# Altium project MCU_board.PrjPcb
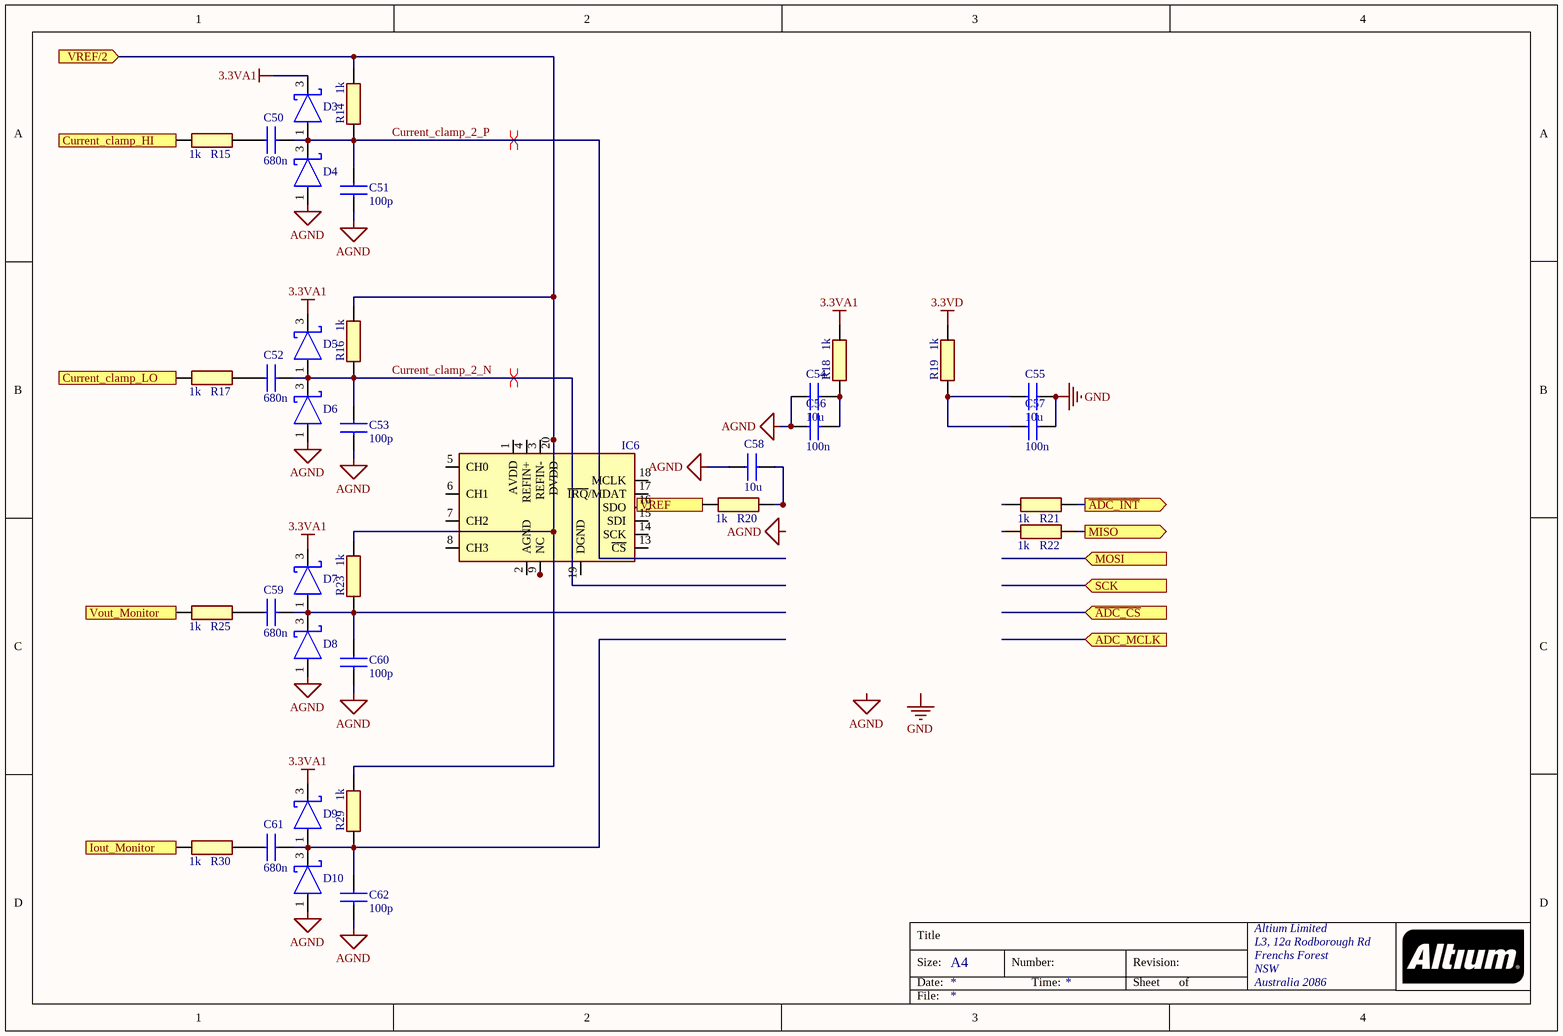
[diagram p0: ADC.SchDoc]
2 sheets, 148 parts. Net scope: flat (ports and power ports of the same name join across sheets).
Board file: analog_and_digital_gnd.PcbDoc
Sheets:
  ADC.SchDoc
  Main.SchDoc

## Sheet ADC.SchDoc
size A4; Organization: Altium Limited; Address1: L3, 12a Rodborough Rd; Address2: Frenchs Forest; Address3: NSW; Address4: Australia 2086

### Parts
C50  value 680n  [R82DC3680AA60J]  (hidden comment: R82DC3680AA60J)
C51  value 100p  [CAPC2012X140N]  (hidden comment: Capacitor_SMD)
C52  value 680n  [R82DC3680AA60J]  (hidden comment: R82DC3680AA60J)
C53  value 100p  [CAPC2012X140N]  (hidden comment: Capacitor_SMD)
C54  value 10u  [CAPC2012X140N]  (hidden comment: Capacitor_SMD)
C55  value 10u  [CAPC2012X140N]  (hidden comment: Capacitor_SMD)
C56  value 100n  [CAPC2012X140N]  (hidden comment: Capacitor_SMD)
C57  value 100n  [CAPC2012X140N]  (hidden comment: Capacitor_SMD)
C58  value 10u  [CAPC2012X140N]  (hidden comment: Capacitor_SMD)
C59  value 680n  [R82DC3680AA60J]  (hidden comment: R82DC3680AA60J)
C60  value 100p  [CAPC2012X140N]  (hidden comment: Capacitor_SMD)
C61  value 680n  [R82DC3680AA60J]  (hidden comment: R82DC3680AA60J)
C62  value 100p  [CAPC2012X140N]  (hidden comment: Capacitor_SMD)
D3  BAS40  [SOT65P210X110-3N]  (value not drawn)
D4  BAS40  [SOT65P210X110-3N]  (value not drawn)
D5  BAS40  [SOT65P210X110-3N]  (value not drawn)
D6  BAS40  [SOT65P210X110-3N]  (value not drawn)
D7  BAS40  [SOT65P210X110-3N]  (value not drawn)
D8  BAS40  [SOT65P210X110-3N]  (value not drawn)
D9  BAS40  [SOT65P210X110-3N]  (value not drawn)
D10  BAS40  [SOT65P210X110-3N]  (value not drawn)
IC6  MCP3462T-E_NC  [SOP65P640X120-20N]  (value not drawn)
R14  value 1k  [RESC2012X60N]  (hidden comment: Res_SMD)
R15  value 1k  [RESC2012X60N]  (hidden comment: Res_SMD)
R16  value 1k  [RESC2012X60N]  (hidden comment: Res_SMD)
R17  value 1k  [RESC2012X60N]  (hidden comment: Res_SMD)
R18  value 1k  [RESC2012X60N]  (hidden comment: Res_SMD)
R19  value 1k  [RESC2012X60N]  (hidden comment: Res_SMD)
R20  value 1k  [RESC2012X60N]  (hidden comment: Res_SMD)
R21  value 1k  [RESC2012X60N]  (hidden comment: Res_SMD)
R22  value 1k  [RESC2012X60N]  (hidden comment: Res_SMD)
R23  value 1k  [RESC2012X60N]  (hidden comment: Res_SMD)
R25  value 1k  [RESC2012X60N]  (hidden comment: Res_SMD)
R29  value 1k  [RESC2012X60N]  (hidden comment: Res_SMD)
R30  value 1k  [RESC2012X60N]  (hidden comment: Res_SMD)

### Ports
ADC_MCLK (in), Current_clamp_HI (in), Current_clamp_LO (in), Iout_Monitor (in), MISO (out), MOSI (in), SCK (in), Vout_Monitor (in), VREF (in), VREF/2 (in), ~{ADC_CS} (in), ~{ADC_INT} (out)

### Nets
3.3VA1: D3.3(K) D5.3(K) D7.3(K) D9.3(K) R18.2
3.3VD: R19.2
AGND: C51.2 C53.2 C54.2 C56.2 C58.2 C60.2 C62.2 D4.1(A) D6.1(A) D8.1(A) D10.1(A)
GND: C55.1 C57.1
~{ADC_INT}: R21.1 ; port ~{ADC_INT}
Current_clamp_2_N: C52.2 C53.1 D5.1(A) D6.3(K) R16.1
Current_clamp_2_P: C50.2 C51.1 D3.1(A) D4.3(K) R14.1
Current_clamp_HI: R15.2 ; port Current_clamp_HI
Current_clamp_LO: R17.2 ; port Current_clamp_LO
Iout_Monitor: R30.2 ; port Iout_Monitor
MISO: R22.1 ; port MISO
Vout_Monitor: R25.2 ; port Vout_Monitor
VREF: R20.2 ; port VREF
VREF/2: IC6.20(DVDD) R14.2 R16.2 R23.2 R29.2 ; port VREF/2
NetC50_1: C50.1 R15.1
NetC52_1: C52.1 R17.1
NetC54_1: C54.1 C56.1 R18.1
NetC55_2: C55.2 C57.2 R19.1
NetC58_1: C58.1 R20.1
NetC59_1: C59.1 R25.1
NetC59_2: C59.2 C60.1 D7.1(A) D8.3(K) R23.1
NetC61_1: C61.1 R30.1
NetC61_2: C61.2 C62.1 D9.1(A) D10.3(K) R29.1
NetIC6_9: IC6.9(NC) IC6.10(NC) IC6.11(NC) IC6.12(NC)

Not connected (* = marked no-connect by the designer): IC6 1(AVDD) 2(AGND) 3(REFIN-) 4(REFIN+) 5(CH0) 6(CH1) 7(CH2) 8(CH3) 13(~{CS}) 14(SCK) 15(SDI) 16(SDO) 17(~{IRQ}/MDAT) 18(MCLK) 19(DGND); R21 2; R22 2

### Layout directives
differential pair: Current_clamp_2_N, Current_clamp_2_P

### Notes on the sheet
- Labels drawn without touching a wire or pin: AGND, GND
- Title
- Size:
- Date:
- A4
- Number:
- Time:
- Revision:
- Sheet
- of
- File:

### Library data of the parts
C50 C52 C59 C61 = R82DC3680AA60J: Capacitor; Manufacturer_Name: Kemet; Datasheet Link: https://www.kemet.com/specsheet/R82DC3680AA60J; Height: 9.6mm; Manufacturer_Part_Number: R82DC3680AA60J; Mouser Part Number: 80-R82DC3680AA60J; Mouser Price/Stock: https://www.mouser.com/Search/Refine.aspx?Keyword=80-R82DC3680AA60J; Arrow Part Number: R82DC3680AA60J; Arrow Price/Stock: https://www.arrow.com/en/products/r82dc3680aa60j/kemet-corporation
C51 C53-C58 C60 C62 = Capacitor_SMD: Capacitor smd ceramic; Manufacturer_Name: TDK; Manufacturer_Part_Number: C3216C0G1H562J060AA; Datasheet Link: https://product.tdk.com/info/en/catalog/datasheets/mlcc_commercial_midvoltage_en.pdf; Height: 0.75mm
D3-D10 = BAS40: Diode; Manufacturer_Name: Nexperia; Manufacturer_Part_Number: BAS40-04W,115; Datasheet Link: https://assets.nexperia.com/documents/data-sheet/BAS40_1PSXXSB4X_SER.pdf; Height: 1.1mm; Mouser Part Number: 771-BAS40-04W-T/R; Mouser Price/Stock: https://www.mouser.co.uk/ProductDetail/Nexperia/BAS40-04W115?qs=me8TqzrmIYWDwJcnI64JHw%3D%3D; Arrow Part Number: BAS40-04W,115; Arrow Price/Stock: https://www.arrow.com/en/products/bas40-04w115/nexperia?region=nac
IC6 = MCP3462T-E_NC: Integrated Circuit; Manufacturer_Name: Microchip; Manufacturer_Part_Number: MCP3462T-E/NC; Datasheet Link: http://ww1.microchip.com/downloads/en/DeviceDoc/MCP3461-2-4_Data-Sheet-20006180A.pdf; Height: 0.6mm; Mouser Part Number: 579-MCP3462T-E/NC; Mouser Price/Stock: https://www.mouser.co.uk/ProductDetail/Microchip-Technology/MCP3462T-E-NC?qs=byeeYqUIh0NcNWUdwm8hpg%3D%3D
R14-R23 R25 R29 R30 = Res_SMD: Resistor SMD; Manufacturer_Name: Bourns; Manufacturer_Part_Number: CR1206-FW-1504ELF; Datasheet Link: http://componentsearchengine.com/Datasheets/1/CR1206-FW-1504ELF.pdf; Height: 0.75mm; Mouser Part Number: 652-CR1206FW1504ELF; Mouser Price/Stock: https://www.mouser.co.uk/ProductDetail/Bourns/CR1206-FW-1504ELF/?qs=6oMev5NRZMFfvXkOpYL2%252BA%3D%3D; Arrow Part Number: CR1206-FW-1504ELF; Arrow Price/Stock: https://www.arrow.com/en/products/cr1206-fw-1504elf/bourns

## Sheet Main.SchDoc
size A3; Organization: Altium Limited; Address1: L3, 12a Rodborough Rd; Address2: Frenchs Forest; Address3: NSW; Address4: Australia 2086
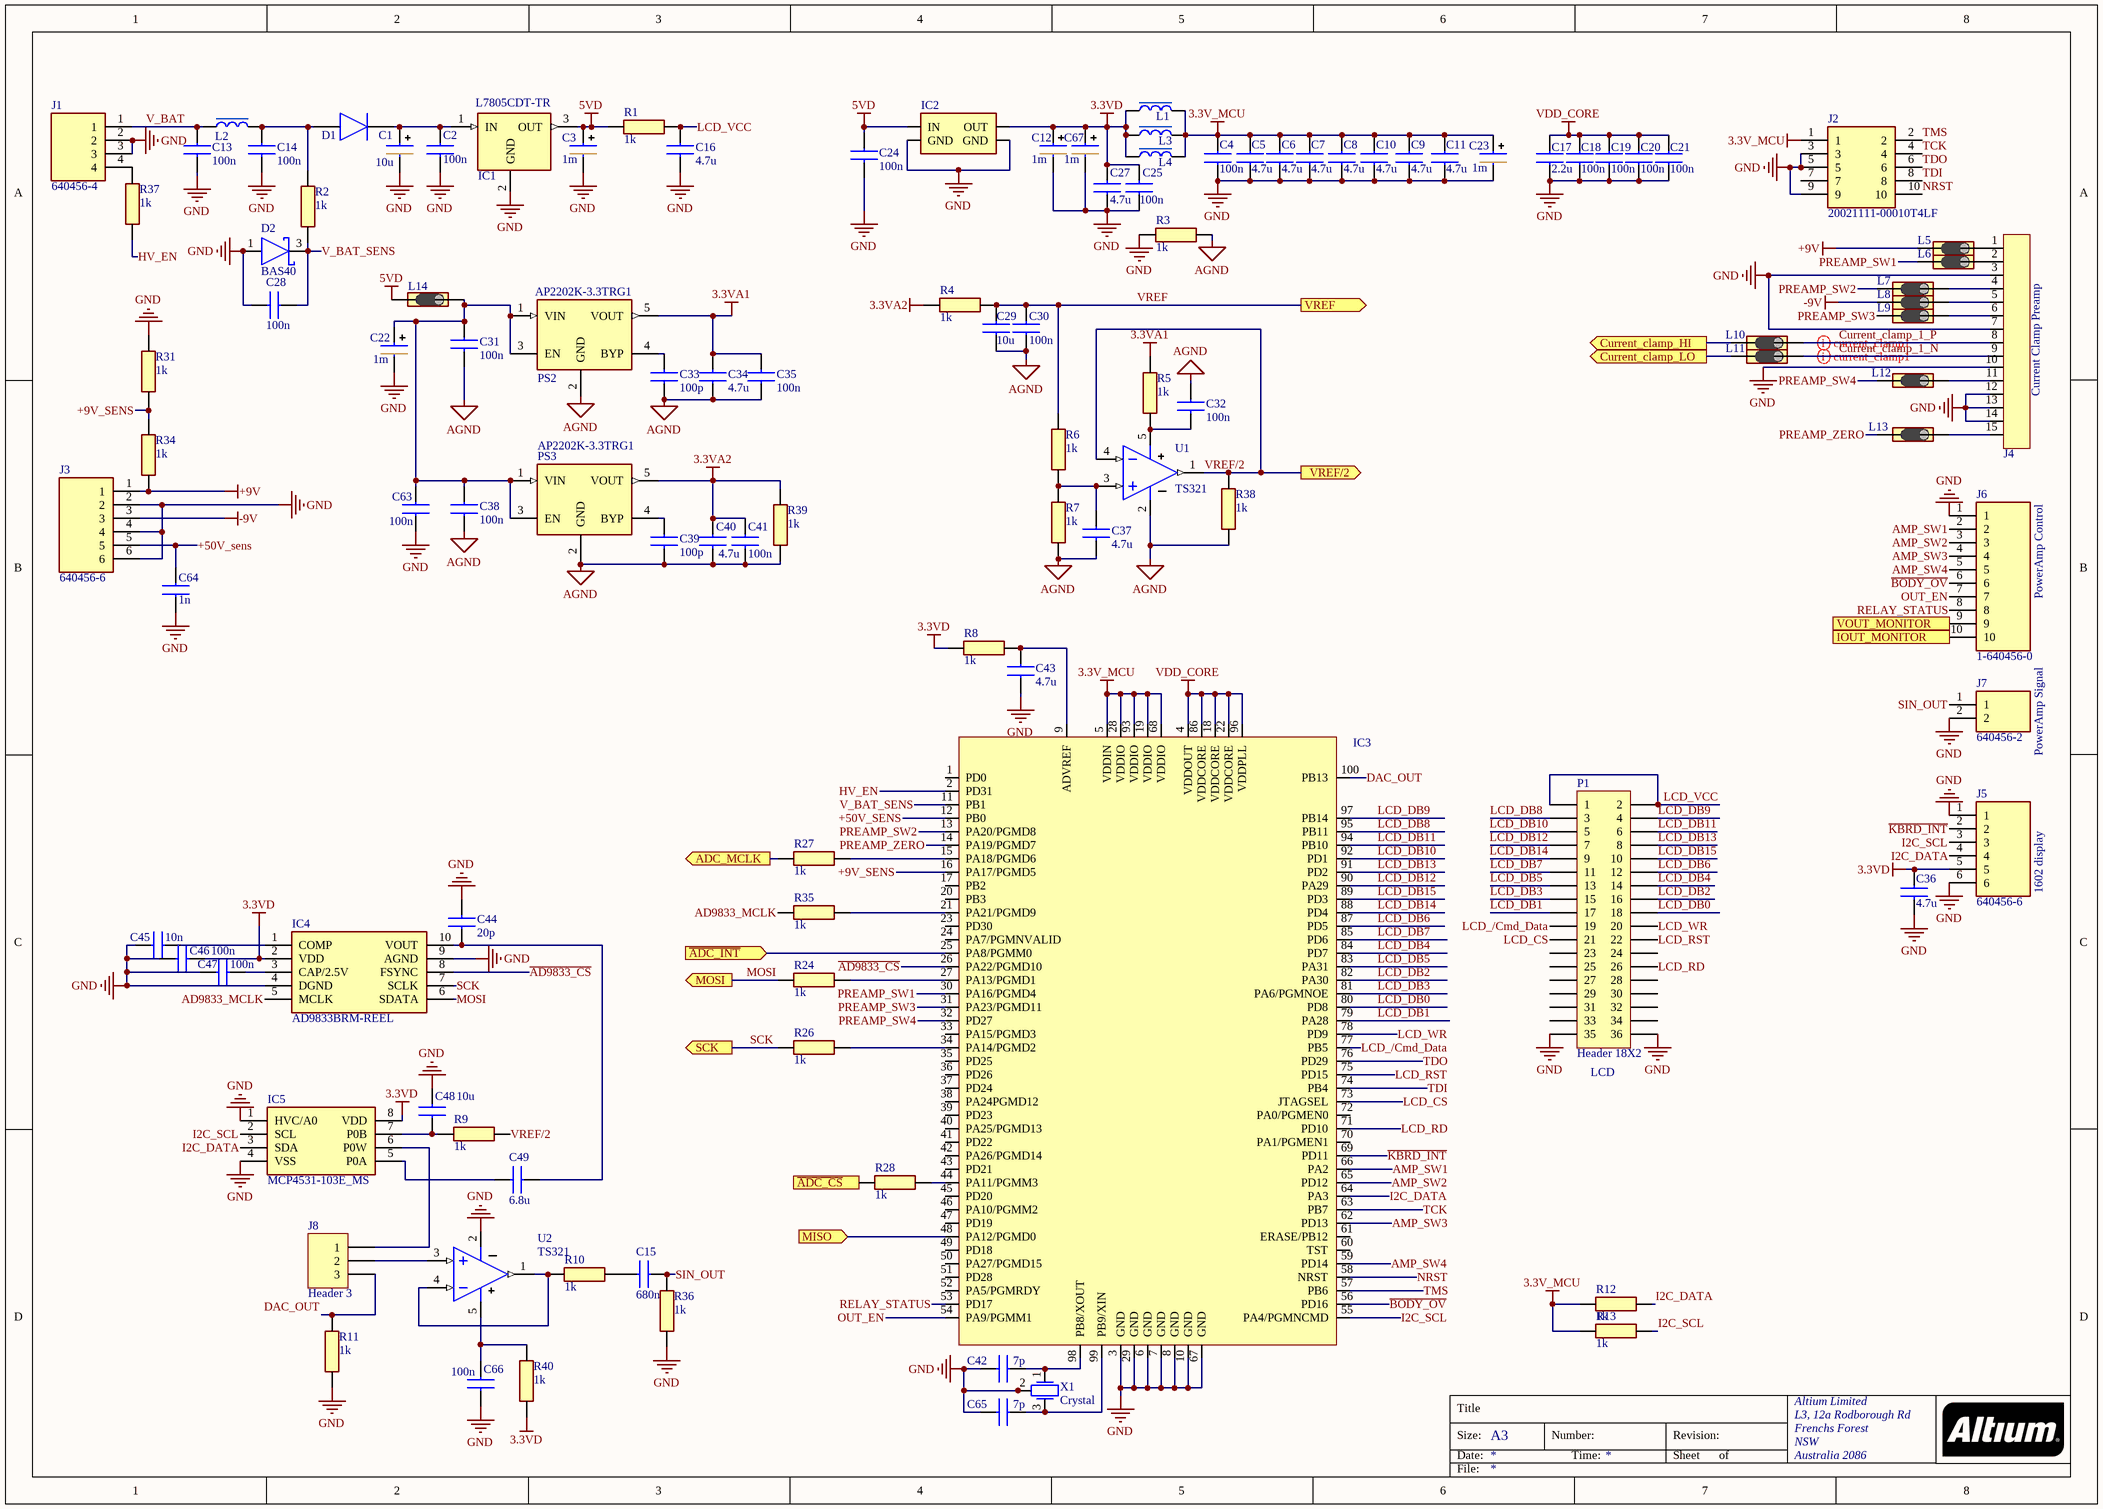
[diagram p1: Main.SchDoc]

### Parts
C1  value 10u  [CAP_EL_8X12R3_5]  (hidden comment: Capacitor Electrolytic)
C2  value 100n  [CAPC2012X140N]  (hidden comment: Capacitor_SMD)
C3  value 1m  [CAP_EL_8X12R3_5]  (hidden comment: Capacitor Electrolytic)
C4  value 100n  [CAPC2012X140N]  (hidden comment: Capacitor_SMD)
C5  value 4.7u  [CAPC2012X140N]  (hidden comment: Capacitor_SMD)
C6  value 4.7u  [CAPC2012X140N]  (hidden comment: Capacitor_SMD)
C7  value 4.7u  [CAPC2012X140N]  (hidden comment: Capacitor_SMD)
C8  value 4.7u  [CAPC2012X140N]  (hidden comment: Capacitor_SMD)
C9  value 4.7u  [CAPC2012X140N]  (hidden comment: Capacitor_SMD)
C10  value 4.7u  [CAPC2012X140N]  (hidden comment: Capacitor_SMD)
C11  value 4.7u  [CAPC2012X140N]  (hidden comment: Capacitor_SMD)
C12  value 1m  [CAP_EL_8X12R3_5]  (hidden comment: Capacitor Electrolytic)
C13  value 100n  [CAPC2012X140N]  (hidden comment: Capacitor_SMD)
C14  value 100n  [CAPC2012X140N]  (hidden comment: Capacitor_SMD)
C15  value 680n  [R82DC3680AA60J]  (hidden comment: R82DC3680AA60J)
C16  value 4.7u  [CAPC2012X140N]  (hidden comment: Capacitor_SMD)
C17  value 2.2u  [CAPC2012X140N]  (hidden comment: Capacitor_SMD)
C18  value 100n  [CAPC2012X140N]  (hidden comment: Capacitor_SMD)
C19  value 100n  [CAPC2012X140N]  (hidden comment: Capacitor_SMD)
C20  value 100n  [CAPC2012X140N]  (hidden comment: Capacitor_SMD)
C21  value 100n  [CAPC2012X140N]  (hidden comment: Capacitor_SMD)
C22  value 1m  [CAP_EL_8X12R3_5]  (hidden comment: Capacitor Electrolytic)
C23  value 1m  [CAP_EL_8X12R3_5]  (hidden comment: Capacitor Electrolytic)
C24  value 100n  [CAPC2012X140N]  (hidden comment: Capacitor_SMD)
C25  value 100n  [CAPC2012X140N]  (hidden comment: Capacitor_SMD)
C27  value 4.7u  [CAPC2012X140N]  (hidden comment: Capacitor_SMD)
C28  value 100n  [CAPC2012X140N]  (hidden comment: Capacitor_SMD)
C29  value 10u  [CAPC2012X140N]  (hidden comment: Capacitor_SMD)
C30  value 100n  [CAPC2012X140N]  (hidden comment: Capacitor_SMD)
C31  value 100n  [CAPC2012X140N]  (hidden comment: Capacitor_SMD)
C32  value 100n  [CAPC2012X140N]  (hidden comment: Capacitor_SMD)
C33  value 100p  [CAPC2012X140N]  (hidden comment: Capacitor_SMD)
C34  value 4.7u  [CAPC2012X140N]  (hidden comment: Capacitor_SMD)
C35  value 100n  [CAPC2012X140N]  (hidden comment: Capacitor_SMD)
C36  value 4.7u  [CAPC2012X140N]  (hidden comment: Capacitor_SMD)
C37  value 4.7u  [CAPC2012X140N]  (hidden comment: Capacitor_SMD)
C38  value 100n  [CAPC2012X140N]  (hidden comment: Capacitor_SMD)
C39  value 100p  [CAPC2012X140N]  (hidden comment: Capacitor_SMD)
C40  value 4.7u  [CAPC2012X140N]  (hidden comment: Capacitor_SMD)
C41  value 100n  [CAPC2012X140N]  (hidden comment: Capacitor_SMD)
C42  value 7p  [CAPC2012X140N]  (hidden comment: Capacitor_SMD)
C43  value 4.7u  [CAPC2012X140N]  (hidden comment: Capacitor_SMD)
C44  value 20p  [CAPC2012X140N]  (hidden comment: Capacitor_SMD)
C45  value 10n  [CAPC2012X140N]  (hidden comment: Capacitor_SMD)
C46  value 100n  [CAPC2012X140N]  (hidden comment: Capacitor_SMD)
C47  value 100n  [CAPC2012X140N]  (hidden comment: Capacitor_SMD)
C48  value 10u  [CAPC2012X140N]  (hidden comment: Capacitor_SMD)
C49  value 6.8u  [CAPC2012X140N]  (hidden comment: Capacitor_SMD)
C63  value 100n  [CAPC2012X140N]  (hidden comment: Capacitor_SMD)
C64  value 1n  [CAPC2012X140N]  (hidden comment: Capacitor_SMD)
C65  value 7p  [CAPC2012X140N]  (hidden comment: Capacitor_SMD)
C66  value 100n  [CAPC2012X140N]  (hidden comment: Capacitor_SMD)
C67  value 1m  [CAP_EL_8X12R3_5]  (hidden comment: Capacitor Electrolytic)
D1  S2B-13-F  [DIOM5336X250N]  (value not drawn)
D2  BAS40  [SOT65P210X110-3N]
IC1  L7805CDT-TR  [L7805CDTTR]
IC2  AP130-33YG-13  [SOT89-3L]  (value not drawn)
IC3  ATSAM4E8CB  [QFP50P1600X1600X160-100N]  (value not drawn)
IC4  AD9833BRM-REEL  [SOP50P490X110-10N]
IC5  MCP4531-103E_MS  [SOP65P490X110-8N]
J1  640456-4  [SHDR4W66P0X254_1X4_1016X572X1041P]
J2  20021111-00010T4LF  [HDRV10W41P127_2X5_635X343X575P]
J3  640456-6  [SHDR6W66P0X254_1X6_1524X572X1003P]
J4  D-Sub 15 pin  [ICD15S13E4GV00LF]  (value not drawn)
J5  640456-6  [SHDR6W66P0X254_1X6_1524X572X1003P]
J6  1-640456-0  [SHDR10W66P0X254_1X10_2540X572X1041P]
J7  640456-2  [SHDR2W66P0X254_1X2_508X572X1041P]
J8  Header 3  [HDR1X3]
L1  Power Inductor SMD  [0805FR68K08]  (value not drawn)
L2  Power Inductor SMD  [DLG05046R8]  (value not drawn)
L3  Power Inductor SMD  [0805FR68K08]  (value not drawn)
L4  Power Inductor SMD  [0805FR68K08]  (value not drawn)
L5  Ferrite Bead  [RESC2012X60N]  (value not drawn)
L6  Ferrite Bead  [RESC2012X60N]  (value not drawn)
L7  Ferrite Bead  [RESC2012X60N]  (value not drawn)
L8  Ferrite Bead  [RESC2012X60N]  (value not drawn)
L9  Ferrite Bead  [RESC2012X60N]  (value not drawn)
L10  Ferrite Bead  [RESC2012X60N]  (value not drawn)
L11  Ferrite Bead  [RESC2012X60N]  (value not drawn)
L12  Ferrite Bead  [RESC2012X60N]  (value not drawn)
L13  Ferrite Bead  [RESC2012X60N]  (value not drawn)
L14  Ferrite Bead  [RESC2012X60N]  (value not drawn)
P1  Header 18X2  [HDR2X18]
PS2  AP2202K-3.3TRG1  [SOT95P280X145-5N]
PS3  AP2202K-3.3TRG1  [SOT95P280X145-5N]
R1  value 1k  [RESC2012X60N]  (hidden comment: Res_SMD)
R2  value 1k  [RESC2012X60N]  (hidden comment: Res_SMD)
R3  value 1k  [RESC2012X60N]  (hidden comment: Res_SMD)
R4  value 1k  [RESC2012X60N]  (hidden comment: Res_SMD)
R5  value 1k  [RESC2012X60N]  (hidden comment: Res_SMD)
R6  value 1k  [RESC2012X60N]  (hidden comment: Res_SMD)
R7  value 1k  [RESC2012X60N]  (hidden comment: Res_SMD)
R8  value 1k  [RESC2012X60N]  (hidden comment: Res_SMD)
R9  value 1k  [RESC2012X60N]  (hidden comment: Res_SMD)
R10  value 1k  [RESC2012X60N]  (hidden comment: Res_SMD)
R11  value 1k  [RESC2012X60N]  (hidden comment: Res_SMD)
R12  value 1k  [RESC2012X60N]  (hidden comment: Res_SMD)
R13  value 1k  [RESC2012X60N]  (hidden comment: Res_SMD)
R24  value 1k  [RESC2012X60N]  (hidden comment: Res_SMD)
R26  value 1k  [RESC2012X60N]  (hidden comment: Res_SMD)
R27  value 1k  [RESC2012X60N]  (hidden comment: Res_SMD)
R28  value 1k  [RESC2012X60N]  (hidden comment: Res_SMD)
R31  value 1k  [RESC2012X60N]  (hidden comment: Res_SMD)
R34  value 1k  [RESC2012X60N]  (hidden comment: Res_SMD)
R35  value 1k  [RESC2012X60N]  (hidden comment: Res_SMD)
R36  value 1k  [RESC2012X60N]  (hidden comment: Res_SMD)
R37  value 1k  [RESC2012X60N]  (hidden comment: Res_SMD)
R38  value 1k  [RESC2012X60N]  (hidden comment: Res_SMD)
R39  value 1k  [RESC2012X60N]  (hidden comment: Res_SMD)
R40  value 1k  [RESC2012X60N]  (hidden comment: Res_SMD)
U1  TS321  [SOT95P280X145-5N]
U2  TS321  [SOT95P280X145-5N]
X1  Crystal  [LFXTAL068911Reel]

### Ports
ADC_MCLK (out), Current_clamp_HI (out), Current_clamp_LO (out), IOUT_MONITOR (out), MISO (in), MOSI (out), SCK (out), VOUT_MONITOR (out), VREF (out), VREF/2 (out), ~{ADC_CS} (out), ~{ADC_INT} (in)

### Nets
3.3V_MCU: C4.1 C5.1 C6.1 C7.1 C8.1 C9.1 C10.1 C11.1 C23.1(+) IC3.5(VDDIN) IC3.19(VDDIO) IC3.28(VDDIO) IC3.68(VDDIO) IC3.93(VDDIO) J2.1 L1.2 L3.2 L4.2 R12.1 R13.1
3.3VA1: C34.2 C35.2 PS2.5(VOUT) R5.2
3.3VA2: C40.2 C41.2 PS3.5(VOUT) R4.2 R39.1
3.3VD: C12.1(+) C25.2 C27.2 C36.1 C46.2 C67.1(+) IC2.1(OUT) IC4.2(VDD) IC5.8(VDD) J5.5 L1.1 L3.1 L4.1 R8.1 R40.1
5VD: C3.1(+) C24.2 IC1.3(OUT) IC2.3(IN) L14.1 R1.1
+9V: J3.1 L5.1 R34.2
-9V: J3.3 L8.1
AGND: C29.2 C30.2 C31.1 C32.1 C33.1 C34.1 C35.1 C37.1 C38.1 C39.1 C40.1 C41.1 PS2.2(GND) PS3.2(GND) R3.2 R7.2 R38.2 R39.2 U1.2(V-)
GND: C1.2(-) C2.1 C3.2(-) C4.2 C5.2 C6.2 C7.2 C8.2 C9.2 C10.2 C11.2 C12.2(-) C13.1 C14.1 C16.1 C17.2 C18.2 C19.1 C20.1 C21.1 C22.2(-) C23.2(-) C24.1 C25.1 C27.1 C28.1 C36.2 C42.1 C43.1 C44.2 C45.1 C46.1 C47.1 C48.1 C63.1 C64.1 C65.1 C66.2 C67.2(-) D2.1(A) IC1.2(GND) IC2.2(GND) IC2.4(GND) IC3.3(GND) IC3.6(GND) IC3.7(GND) IC3.8(GND) IC3.10(GND) IC3.29(GND) IC3.67(GND) IC4.4(DGND) IC4.9(AGND) IC5.1(HVC/A0) IC5.4(VSS) J1.2 J1.3 J2.3 J2.5 J2.9 J3.2 J3.4 J3.6 J4.3 J4.7 J4.10 J4.12 J4.13 J4.14 J5.1 J5.6 J6.1 J7.2 P1.35 P1.36 R3.1 R11.2 R31.1 R36.2 U2.2(V-) X1.2(GND) X1.4(GND)
VDD_CORE: C17.1 C18.1 C19.2 C20.2 C21.2 IC3.4(VDDOUT) IC3.18(VDDCORE) IC3.22(VDDCORE) IC3.86(VDDCORE) IC3.96(VDDPLL)
+9V_SENS: IC3.16(PA17/PGMD5) R31.2 R34.1
+50V_sens: C64.2 IC3.12(PB0) J3.5
~{AD9833_CS}: IC3.26(PA22/PGMD10) IC4.8(FSYNC)
~{ADC_CS}: R28.2 ; port ~{ADC_CS}
~{ADC_INT}: IC3.25(PA8/PGMM0) ; port ~{ADC_INT}
~{BODY_OV}: IC3.56(PD16) J6.6
~{KBRD_INT}: IC3.69(PD11) J5.2
AD9833_MCLK: IC4.5(MCLK) R35.2
ADC_MCLK: R27.2 ; port ADC_MCLK
AMP_SW1: IC3.66(PA2) J6.2
AMP_SW2: IC3.65(PD12) J6.3
AMP_SW3: IC3.62(PD13) J6.4
AMP_SW4: IC3.59(PD14) J6.5
Current_clamp_1_N: J4.9 L11.2
Current_clamp_1_P: J4.8 L10.2
Current_clamp_HI: L10.1 ; port Current_clamp_HI
Current_clamp_LO: L11.1 ; port Current_clamp_LO
DAC_OUT: IC3.100(PB13) J8.3 R11.1
HV_EN: IC3.2(PD31) R37.2
I2C_DATA: IC3.64(PA3) IC5.3(SDA) J5.4 R12.2
I2C_SCL: IC3.55(PA4/PGMNCMD) IC5.2(SCL) J5.3 R13.2
Iout_Monitor: J6.10 ; port IOUT_MONITOR
LCD_/Cmd_Data: IC3.77(PB5) P1.19
LCD_CS: IC3.73(JTAGSEL) P1.21
LCD_DB0: IC3.80(PD8) P1.18
LCD_DB1: IC3.79(PA28) P1.17
LCD_DB2: IC3.82(PA30) P1.16
LCD_DB3: IC3.81(PA6/PGMNOE) P1.15
LCD_DB4: IC3.84(PD7) P1.14
LCD_DB5: IC3.83(PA31) P1.13
LCD_DB6: IC3.87(PD5) P1.12
LCD_DB7: IC3.85(PD6) P1.11
LCD_DB8: IC3.95(PB11) P1.3
LCD_DB9: IC3.97(PB14) P1.4
LCD_DB10: IC3.92(PD1) P1.5
LCD_DB11: IC3.94(PB10) P1.6
LCD_DB12: IC3.90(PA29) P1.7
LCD_DB13: IC3.91(PD2) P1.8
LCD_DB14: IC3.88(PD4) P1.9
LCD_DB15: IC3.89(PD3) P1.10
LCD_RD: IC3.71(PD10) P1.26
LCD_RST: IC3.75(PD15) P1.22
LCD_VCC: C16.2 P1.1 P1.2 R1.2
LCD_WR: IC3.78(PD9) P1.20
MISO: IC3.48(PA12/PGMD0) ; port MISO
MOSI: IC4.6(SDATA) R24.2 ; port MOSI
NRST: IC3.58(NRST) J2.10
OUT_EN: IC3.54(PA9/PGMM1) J6.7
PREAMP_SW1: IC3.30(PA16/PGMD4) L6.1
PREAMP_SW2: IC3.13(PA20/PGMD8) L7.1
PREAMP_SW3: IC3.31(PA23/PGMD11) L9.1
PREAMP_SW4: IC3.32(PD27) L12.1
PREAMP_ZERO: IC3.14(PA19/PGMD7) L13.1
RELAY_STATUS: IC3.53(PD17) J6.8
SCK: IC4.7(SCLK) R26.2 ; port SCK
SIN_OUT: C15.2 J7.1 R36.1
TCK: IC3.63(PB7) J2.4
TDI: IC3.74(PB4) J2.8
TDO: IC3.76(PD29) J2.6
TMS: IC3.57(PB6) J2.2
V_BAT: C13.2 J1.1 L2.1
V_BAT_SENS: C28.2 D2.3(K) IC3.11(PB1) R2.2
Vout_Monitor: J6.9 ; port VOUT_MONITOR
VREF: C29.1 C30.1 R4.1 R6.1 ; port VREF
VREF/2: R9.1 R38.1 U1.1(OUT) U1.4(IN-) ; port VREF/2
NetC1_1: C1.1(+) C2.2 D1.1(K) IC1.1(IN)
NetC14_2: C14.2 D1.2(A) L2.2 R2.1
NetC15_1: C15.1 R10.1
NetC22_1: C22.1(+) C31.2 C38.2 C63.2 L14.2 PS2.1(VIN) PS2.3(EN) PS3.1(VIN) PS3.3(EN)
NetC32_2: C32.2 R5.1 U1.5(V+)
NetC33_2: C33.2 PS2.4(BYP)
NetC37_2: C37.2 R6.2 R7.1 U1.3(IN+)
NetC39_2: C39.2 PS3.4(BYP)
NetC42_2: C42.2 IC3.98(PB8/XOUT) X1.1(X1)
NetC43_2: C43.2 IC3.9(ADVREF) R8.2
NetC44_1: C44.1 C49.2 IC4.10(VOUT)
NetC45_2: C45.2 IC4.1(COMP)
NetC47_2: C47.2 IC4.3(CAP/2.5V)
NetC48_2: C48.2 IC5.7(P0B) R9.2
NetC49_1: C49.1 IC5.5(P0A)
NetC65_2: C65.2 IC3.99(PB9/XIN) X1.3(X2)
NetC66_1: C66.1 R40.2 U2.5(V+)
NetIC3_15: IC3.15(PA18/PGMD6) R27.1
NetIC3_21: IC3.21(PA21/PGMD9) R35.1
NetIC3_27: IC3.27(PA13/PGMD1) R24.1
NetIC3_34: IC3.34(PA14/PGMD2) R26.1
NetIC3_44: IC3.44(PA11/PGMM3) R28.1
NetIC5_6: IC5.6(P0W) J8.1
NetJ1_4: J1.4 R37.1
NetJ4_1: J4.1 L5.2
NetJ4_2: J4.2 L6.2
NetJ4_4: J4.4 L7.2
NetJ4_5: J4.5 L8.2
NetJ4_6: J4.6 L9.2
NetJ4_11: J4.11 L12.2
NetJ4_15: J4.15 L13.2
NetJ8_2: J8.2 U2.3(IN+)
NetR10_2: R10.2 U2.1(OUT) U2.4(IN-)

Not connected (* = marked no-connect by the designer): IC3 1(PD0) 17(PB2) 20(PB3) 23(PD30) 24(PA7/PGMNVALID) 33(PA15/PGMD3) 35(PD25) 36(PD26) 37(PD24) 38(PA24PGMD12) 39(PD23) 40(PA25/PGMD13) 41(PD22) 42(PA26/PGMD14) 43(PD21) 45(PD20) 46(PA10/PGMM2) 47(PD19) 49(PD18) 50(PA27/PGMD15) 51(PD28) 52(PA5/PGMRDY) 60(TST) 61(ERASE/PB12) 70(PA1/PGMEN1) 72(PA0/PGMEN0); J2 7; P1 23 24 25 27 28 29 30 31 32 33 34

### Layout directives
differential pair: Current_clamp_1_N, Current_clamp_1_P

### Notes on the sheet
- (near J4) Current Clamp Preamp
- PowerAmp Control
- PowerAmp Signal
- 1602 display
- (near P1) LCD
- Title
- Size:
- Date:
- A3
- Number:
- Time:
- Revision:
- Sheet
- of
- File:

### Library data of the parts
C1 C3 C12 C22 C23 C67 = Capacitor Electrolytic: Capacitor polarized electrolytic; Manufacturer_Name: TDK; Manufacturer_Part_Number: B43640A9477M; Datasheet Link: https://componentsearchengine.com/Datasheets/1/B43640A9477M.pdf; Height: 52mm; Mouser Part Number: 871-B43640A9477M
C2 C4-C11 C13 C14 C16-C21 C24 C25 C27-C49 C63-C66 = Capacitor_SMD: as C51 on sheet ADC; Datasheet Link: https://product.tdk.com/info/en/catalog/datasheets/mlcc_commercial_midvoltage_en.pdf; Height: 0.75mm
C15 = R82DC3680AA60J: Capacitor; Manufacturer_Name: Kemet; Datasheet Link: https://www.kemet.com/specsheet/R82DC3680AA60J; Height: 9.6mm; Manufacturer_Part_Number: R82DC3680AA60J; Mouser Part Number: 80-R82DC3680AA60J; Mouser Price/Stock: https://www.mouser.com/Search/Refine.aspx?Keyword=80-R82DC3680AA60J; Arrow Part Number: R82DC3680AA60J; Arrow Price/Stock: https://www.arrow.com/en/products/r82dc3680aa60j/kemet-corporation
D1 = S2B-13-F: Diode; Manufacturer_Name: Diodes Inc.; Datasheet Link: https://www.diodes.com/assets/Datasheets/ds16004.pdf; Height: 2.5mm; Manufacturer_Part_Number: S2B-13-F; Mouser Part Number: 621-S2B-F; Mouser Price/Stock: https://www.mouser.com/Search/Refine.aspx?Keyword=621-S2B-F; Arrow Part Number: S2B-13-F; Arrow Price/Stock: https://www.arrow.com/en/products/s2b-13-f/diodes-incorporated
D2 = BAS40: as D3 on sheet ADC; Datasheet Link: https://assets.nexperia.com/documents/data-sheet/BAS40_1PSXXSB4X_SER.pdf; Height: 1.1mm; Mouser Part Number: 771-BAS40-04W-T/R; Mouser Price/Stock: https://www.mouser.co.uk/ProductDetail/Nexperia/BAS40-04W115?qs=me8TqzrmIYWDwJcnI64JHw%3D%3D; Arrow Part Number: BAS40-04W,115; Arrow Price/Stock: https://www.arrow.com/en/products/bas40-04w115/nexperia?region=nac
IC1 = L7805CDT-TR: Integrated Circuit; Manufacturer_Name: STMicroelectronics; Datasheet Link: https://componentsearchengine.com/Datasheets/2/L7805CDT-TR.pdf; Height: 2.63mm; Manufacturer_Part_Number: L7805CDT-TR; Mouser Part Number: 511-L7805CDT-TR; Mouser Price/Stock: https://www.mouser.co.uk/ProductDetail/STMicroelectronics/L7805CDT-TR/?qs=gq%2F78KzUDX67VndS%2FbSB4Q%3D%3D; Arrow Part Number: L7805CDT-TR; Arrow Price/Stock: https://www.arrow.com/en/products/l7805cdt-tr/stmicroelectronics
IC2 = AP130-33YG-13: Integrated Circuit; Manufacturer_Name: Diodes Inc.; Datasheet Link: https://www.diodes.com/assets/Datasheets/AP130.pdf; Manufacturer_Part_Number: AP130-33YG-13; Mouser Part Number: 621-AP130-33YG-13; Mouser Price/Stock: https://www.mouser.com/Search/Refine.aspx?Keyword=621-AP130-33YG-13
IC3 = ATSAM4E8CB: 512kFlash 128kSRAM FPU; Arrow Part Number: ATSAM4E8CB-ANR
IC4 = AD9833BRM-REEL: Integrated Circuit; Manufacturer_Name: Analog Devices; Datasheet Link: https://datasheet.datasheetarchive.com/originals/distributors/Datasheets-SFU1/DSASFU10004310.pdf; Height: 1.1mm; Manufacturer_Part_Number: AD9833BRM-REEL
IC5 = MCP4531-103E_MS: Integrated Circuit; Manufacturer_Name: Microchip; Manufacturer_Part_Number: MCP4531-103E/MS; Datasheet Link: http://ww1.microchip.com/downloads/en/DeviceDoc/22096b.pdf; Height: 1.1mm; Mouser Part Number: 579-MCP4531-103E/MS; Mouser Price/Stock: https://www.mouser.co.uk/ProductDetail/Microchip-Technology/MCP4531-103E-MS/?qs=hH%252BOa0VZEiCnxdBK%2FqmQ8g%3D%3D; Arrow Part Number: MCP4531-103E/MS; Arrow Price/Stock: https://www.arrow.com/en/products/mcp4531-103ems/microchip-technology
J1 = 640456-4: Connector; Manufacturer_Name: TE Connectivity; Datasheet Link: http://www.te.com/commerce/DocumentDelivery/DDEController?Action=showdoc&DocId=Customer+Drawing%7F640456%7FW3%7Fpdf%7FEnglish%7FENG_CD_640456_W3.pdf%7F640456-4; Height: 10.414mm; Manufacturer_Part_Number: 640456-4; Mouser Part Number: 571-6404564; Mouser Price/Stock: https://www.mouser.co.uk/ProductDetail/TE-Connectivity-AMP/640456-4?qs=%2F35zJ5USjokX5rl%252BbVBc4g%3D%3D; Arrow Part Number: 640456-4; Arrow Price/Stock: https://www.arrow.com/en/products/640456-4/te-connectivity; System: Connector
J2 = 20021111-00010T4LF: Connector; Manufacturer_Name: Amphenol; Datasheet Link: https://www.mouser.it/datasheet/2/18/20021111-1362952.pdf; Height: 5.75mm; Manufacturer_Part_Number: 20021111-00010T4LF; Arrow Part Number: 20021111-00010T4LF; Arrow Price/Stock: https://www.arrow.com/en/products/20021111-00010t4lf/amphenol-fci; Mouser Part Number: 649-221111-00010T4LF; Mouser Price/Stock: https://www.mouser.co.uk/ProductDetail/Amphenol-FCI/20021111-00010T4LF?qs=nwYJ12Fl9gR8B5xkaYs9gA%3D%3D
J3 J5 = 640456-6: Connector; Manufacturer_Name: TE Connectivity; Datasheet Link: https://www.mouser.com/ProductDetail/TE-Connectivity/640456-6?qs=%2F35zJ5USjomb%252bGgX%252bBnrrQ%3D%3D&gclid=CjwKCAjwkoz7BRBPEiwAeKw3q0mcLif-2aBBbbX-TwuIeMidB_ARULgbAE-SJPQzeNro84r-4lxoHhoCr1IQAvD_BwE; Height: 10.033mm; Manufacturer_Part_Number: 640456-6; Mouser Part Number: 571-6404566; Mouser Price/Stock: https://www.mouser.co.uk/ProductDetail/TE-Connectivity-AMP/640456-6?qs=%2F35zJ5USjomb%252BGgX%252BBnrrQ%3D%3D; Arrow Part Number: 640456-6; Arrow Price/Stock: https://www.arrow.com/en/products/640456-6/te-connectivity
  J3: System: Connector
J4 = D-Sub 15 pin: Connector D sub 9 pin pcb angled 90; Manufacturer_Name: Amphenol; Datasheet Link: https://www.amphenol-icc.com/media/wysiwyg/files/drawing/c-cd-0012.pdf; Height: 12.96mm; Manufacturer_Part_Number: ICD15S13E4GV00LF; Mouser Part Number: 649-ICD15S13E4GV00LF; Mouser Price/Stock: https://www.mouser.co.uk/ProductDetail/Amphenol-FCI/ICD15S13E4GV00LF?qs=XRaITl65jntmDA26LPPFrA%3D%3D; Arrow Part Number: ICD15S13E4GV00LF; Arrow Price/Stock: https://www.arrow.com/en/products/icd15s13e4gv00lf/amphenol-fci; System: Connector
J6 = 1-640456-0: Connector; Manufacturer_Name: TE Connectivity; Datasheet Link: http://docs-emea.rs-online.com/webdocs/1570/0900766b81570371.pdf; Height: 10.414mm; Manufacturer_Part_Number: 1-640456-0; Mouser Part Number: 571-16404560; Mouser Price/Stock: https://www.mouser.co.uk/ProductDetail/TE-Connectivity-AMP/1-640456-0?qs=%2F35zJ5USjomFMMbv03PGrg%3D%3D; Arrow Part Number: 1-640456-0; Arrow Price/Stock: https://www.arrow.com/en/products/1-640456-0/te-connectivity; System: Connector
J7 = 640456-2: Connector; Manufacturer_Name: TE Connectivity; Datasheet Link: http://www.te.com/commerce/DocumentDelivery/DDEController?Action=showdoc&DocId=Customer+Drawing%7F640456%7FW3%7Fpdf%7FEnglish%7FENG_CD_640456_W3.pdf%7F640456-2; Height: 10.414mm; Manufacturer_Part_Number: 640456-2; Mouser Part Number: 571-6404562; Mouser Price/Stock: https://www.mouser.co.uk/ProductDetail/TE-Connectivity-AMP/640456-2?qs=%2F35zJ5USjomRu3EJQJgZCQ%3D%3D; Arrow Part Number: 640456-2; Arrow Price/Stock: https://www.arrow.com/en/products/640456-2/te-connectivity
J8 = Header 3: Header, 3-Pin; LatestRevisionDate: 17-Jul-2002; LatestRevisionNote: Re-released for DXP Platform.; Publisher: Altium Limited
L1-L4 = Power Inductor SMD: SMD Power Inductor, many packages; Arrow Part Number: Inductor
L5-L14 = Ferrite Bead: Bead ferrite
P1 = Header 18X2: Header, 18-Pin, Dual row; LatestRevisionDate: 17-Jul-2002; LatestRevisionNote: Re-released for DXP Platform.; Publisher: Altium Limited
PS2 PS3 = AP2202K-3.3TRG1: Power Supply; Manufacturer_Name: Diodes Inc.; Datasheet Link: http://uk.rs-online.com/web/p/products/8287397P; Height: 1.45mm; Manufacturer_Part_Number: AP2202K-3.3TRG1; Mouser Part Number: 621-AP2202K-3.3TRG1; Mouser Price/Stock: https://www.mouser.co.uk/ProductDetail/Diodes-Incorporated/AP2202K-33TRG1/?qs=x6A8l6qLYDAsnlCTBZhf4g%3D%3D; Arrow Part Number: AP2202K-3.3TRG1; Arrow Price/Stock: https://www.arrow.com/en/products/ap2202k-3.3trg1/diodes-incorporated
R1-R13 R24 R26-R28 R31 R34-R40 = Res_SMD: as R14 on sheet ADC; Datasheet Link: http://componentsearchengine.com/Datasheets/1/CR1206-FW-1504ELF.pdf; Height: 0.75mm; Mouser Part Number: 652-CR1206FW1504ELF; Mouser Price/Stock: https://www.mouser.co.uk/ProductDetail/Bourns/CR1206-FW-1504ELF/?qs=6oMev5NRZMFfvXkOpYL2%252BA%3D%3D; Arrow Part Number: CR1206-FW-1504ELF; Arrow Price/Stock: https://www.arrow.com/en/products/cr1206-fw-1504elf/bourns
U1 U2 = TS321AILT: single chanel GP opamp (fromground) 800kHz; Nchanels: 1; Fmax: 800kHz; Arrow Part Number: TS321
X1 = Crystal: SMD Crystal; Manufacturer_Name: IQD; Datasheet Link: https://www.mouser.com/datasheet/2/741/LFXTAL068911Reel-1085465.pdf; Height: 0.8mm; Manufacturer_Part_Number: LFXTAL068911Reel; Mouser Part Number: 449-LFXTAL068911REEL; Mouser Price/Stock: https://www.mouser.co.uk/ProductDetail/IQD/LFXTAL068911Reel/?qs=P0I6NS6hZySNkBIXsFzNww%3D%3D; Arrow Part Number: CFPX-180

## Nets that join several sheets
3.3VA1: ADC (5 pins), Main (C34.2 C35.2 PS2.5 R5.2)
3.3VD: ADC (R19.2), Main (15 pins)
AGND: ADC (11 pins), Main (19 pins)
GND: ADC (C55.1 C57.1), Main (81 pins)
~{ADC_INT}: ADC (R21.1), Main (IC3.25)
Current_clamp_HI: ADC (R15.2), Main (L10.1)
Current_clamp_LO: ADC (R17.2), Main (L11.1)
Iout_Monitor: ADC (R30.2), Main (J6.10)
MISO: ADC (R22.1), Main (IC3.48)
Vout_Monitor: ADC (R25.2), Main (J6.9)
VREF: ADC (R20.2), Main (C29.1 C30.1 R4.1 R6.1)
VREF/2: ADC (5 pins), Main (R9.1 R38.1 U1.1 U1.4)

## Assembly variants
with_ad9833: all parts fitted
withOUT_ad9833: not fitted C43 C44 C45 C46 C47 C48 IC? IC? R11